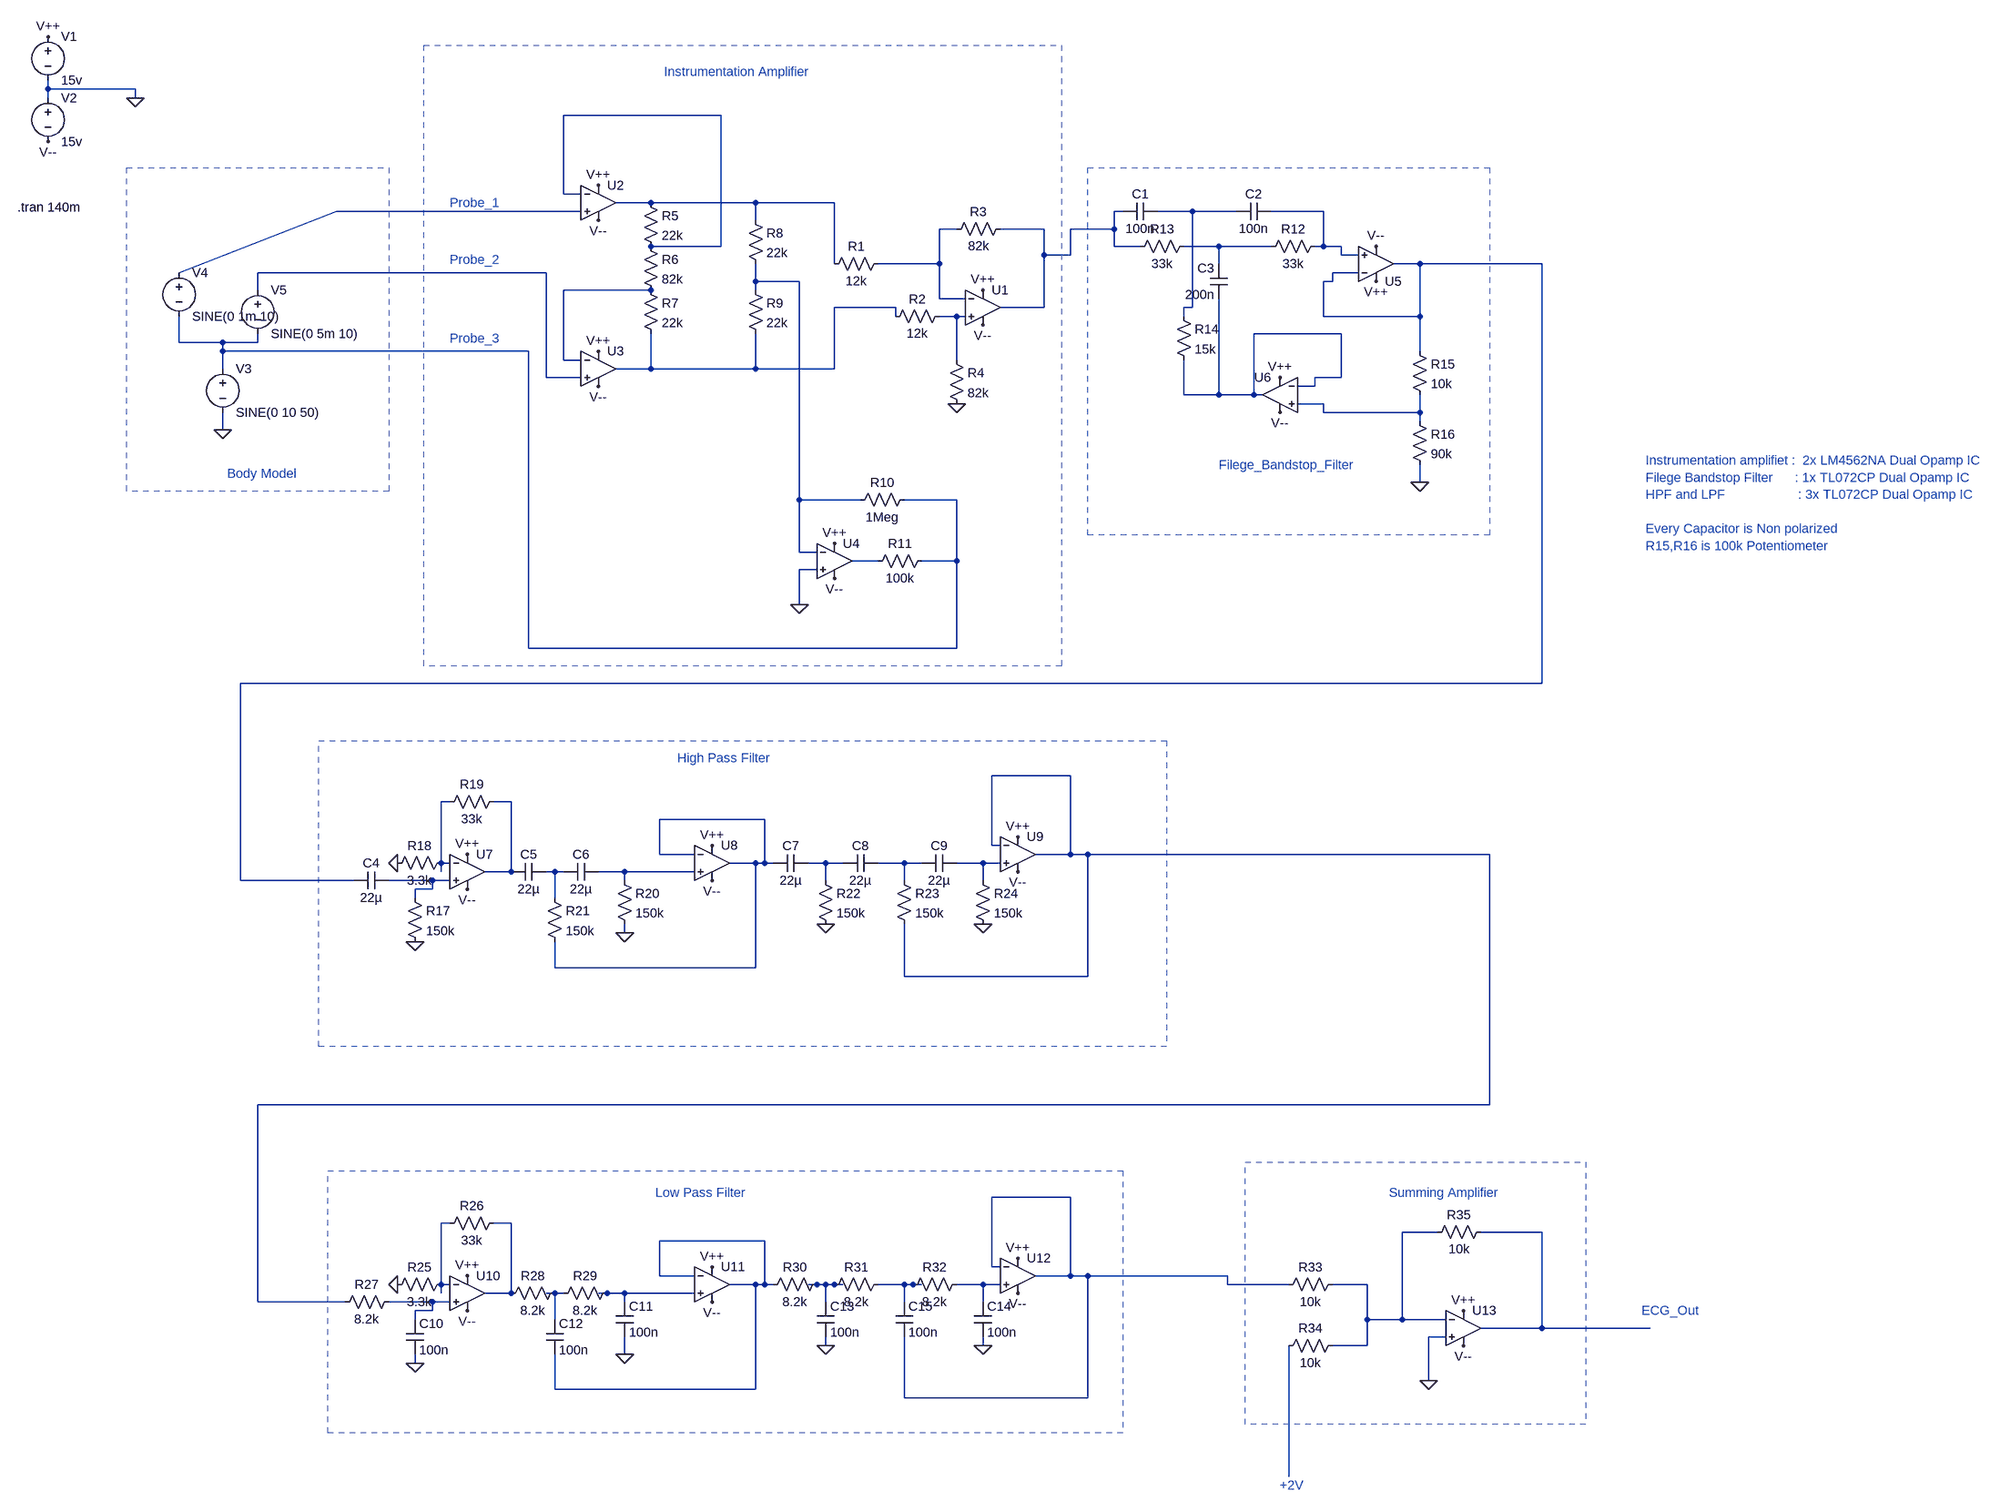
[diagram p0: schematic Full_Simulation.asc]
Full_Simulation.asc, the LTspice schematic file:
Version 4
SHEET 1 1884 2784
WIRE -1728 -80 -1728 -96
WIRE -1568 -80 -1728 -80
WIRE -1728 -64 -1728 -80
WIRE -1568 -64 -1568 -80
WIRE -496 -32 -784 -32
WIRE -784 112 -784 -32
WIRE -752 112 -784 112
WIRE -624 128 -688 128
WIRE -432 128 -624 128
WIRE -288 128 -432 128
WIRE -752 144 -1200 144
WIRE 240 144 224 144
WIRE 368 144 304 144
WIRE 448 144 368 144
WIRE 608 144 512 144
WIRE -432 160 -432 128
WIRE -64 176 -96 176
WIRE 96 176 16 176
WIRE 224 176 224 144
WIRE 224 176 144 176
WIRE -496 208 -496 -32
WIRE -496 208 -624 208
WIRE 224 208 224 176
WIRE 272 208 224 208
WIRE 416 208 352 208
WIRE 512 208 416 208
WIRE 608 208 608 144
WIRE 608 208 592 208
WIRE 640 208 608 208
WIRE 96 224 96 176
WIRE 144 224 144 176
WIRE 144 224 96 224
WIRE 640 224 640 208
WIRE 672 224 640 224
WIRE -288 240 -288 128
WIRE -96 240 -96 176
WIRE -96 240 -208 240
WIRE 416 240 416 208
WIRE 784 240 736 240
WIRE 1008 240 784 240
WIRE -1488 256 -1200 144
WIRE -816 256 -1344 256
WIRE 672 256 624 256
WIRE -432 272 -432 240
WIRE -352 272 -432 272
WIRE 624 272 624 256
WIRE 624 272 608 272
WIRE -1344 288 -1344 256
WIRE -624 288 -784 288
WIRE -432 288 -432 272
WIRE -96 304 -96 240
WIRE -48 304 -96 304
WIRE -176 320 -288 320
WIRE 96 320 96 224
WIRE 96 320 16 320
WIRE 368 320 368 144
WIRE 368 320 352 320
WIRE -176 336 -176 320
WIRE -64 336 -96 336
WIRE -48 336 -64 336
WIRE 352 336 352 320
WIRE 608 336 608 272
WIRE 784 336 784 240
WIRE 784 336 608 336
WIRE 640 368 480 368
WIRE -1488 384 -1488 336
WIRE -1408 384 -1488 384
WIRE -1344 384 -1344 368
WIRE -1344 384 -1408 384
WIRE -1408 400 -1408 384
WIRE -848 400 -1408 400
WIRE 784 400 784 336
WIRE -784 416 -784 288
WIRE -752 416 -784 416
WIRE -64 416 -64 336
WIRE -1408 432 -1408 400
WIRE -624 432 -624 368
WIRE -624 432 -688 432
WIRE -432 432 -432 368
WIRE -432 432 -624 432
WIRE -288 432 -288 320
WIRE -288 432 -432 432
WIRE -816 448 -816 256
WIRE -752 448 -816 448
WIRE 640 448 640 368
WIRE 640 448 592 448
WIRE 592 464 592 448
WIRE 592 464 560 464
WIRE 352 480 352 416
WIRE 416 480 416 304
WIRE 416 480 352 480
WIRE 480 480 480 368
WIRE 480 480 416 480
WIRE 496 480 480 480
WIRE 608 496 560 496
WIRE 608 512 608 496
WIRE 784 512 784 480
WIRE 784 512 608 512
WIRE 784 528 784 512
WIRE -1408 544 -1408 512
WIRE 784 640 784 608
WIRE -352 672 -352 272
WIRE -240 672 -352 672
WIRE -64 672 -160 672
WIRE -352 768 -352 672
WIRE -320 768 -352 768
WIRE -208 784 -256 784
WIRE -64 784 -64 672
WIRE -64 784 -128 784
WIRE -320 800 -352 800
WIRE -352 864 -352 800
WIRE -848 944 -848 400
WIRE -64 944 -64 784
WIRE -64 944 -848 944
WIRE 1008 1008 1008 240
WIRE 1008 1008 -1376 1008
WIRE 144 1232 0 1232
WIRE -992 1280 -1008 1280
WIRE -880 1280 -912 1280
WIRE -416 1312 -608 1312
WIRE 0 1360 0 1232
WIRE 16 1360 0 1360
WIRE -608 1376 -608 1312
WIRE -544 1376 -608 1376
WIRE 144 1376 144 1232
WIRE 144 1376 80 1376
WIRE 176 1376 144 1376
WIRE 912 1376 176 1376
WIRE -1008 1392 -1008 1280
WIRE -992 1392 -1008 1392
WIRE -432 1392 -480 1392
WIRE -416 1392 -416 1312
WIRE -416 1392 -432 1392
WIRE -400 1392 -416 1392
WIRE -304 1392 -336 1392
WIRE -272 1392 -304 1392
WIRE -160 1392 -208 1392
WIRE -128 1392 -160 1392
WIRE -16 1392 -64 1392
WIRE 16 1392 -16 1392
WIRE -1008 1408 -1008 1392
WIRE -880 1408 -880 1280
WIRE -880 1408 -928 1408
WIRE -800 1408 -816 1408
WIRE -784 1408 -800 1408
WIRE -672 1408 -720 1408
WIRE -544 1408 -672 1408
WIRE -1376 1424 -1376 1008
WIRE -1168 1424 -1376 1424
WIRE -1024 1424 -1104 1424
WIRE -992 1424 -1024 1424
WIRE -672 1424 -672 1408
WIRE -304 1424 -304 1392
WIRE -160 1424 -160 1392
WIRE -16 1424 -16 1392
WIRE -1024 1440 -1024 1424
WIRE -1024 1440 -1056 1440
WIRE -1056 1456 -1056 1440
WIRE -800 1456 -800 1408
WIRE -672 1520 -672 1504
WIRE -800 1584 -800 1536
WIRE -432 1584 -432 1392
WIRE -432 1584 -800 1584
WIRE -160 1600 -160 1504
WIRE 176 1600 176 1376
WIRE 176 1600 -160 1600
WIRE 912 1920 912 1376
WIRE 912 1920 -1344 1920
WIRE 144 2192 0 2192
WIRE -992 2240 -1008 2240
WIRE -880 2240 -912 2240
WIRE 816 2256 752 2256
WIRE 1008 2256 896 2256
WIRE -416 2272 -608 2272
WIRE 0 2320 0 2192
WIRE 16 2320 0 2320
WIRE -608 2336 -608 2272
WIRE -544 2336 -608 2336
WIRE 144 2336 144 2192
WIRE 144 2336 80 2336
WIRE 176 2336 144 2336
WIRE 432 2336 176 2336
WIRE -1008 2352 -1008 2240
WIRE -992 2352 -1008 2352
WIRE -432 2352 -480 2352
WIRE -416 2352 -416 2272
WIRE -416 2352 -432 2352
WIRE -400 2352 -416 2352
WIRE -320 2352 -336 2352
WIRE -304 2352 -320 2352
WIRE -288 2352 -304 2352
WIRE -272 2352 -288 2352
WIRE -160 2352 -208 2352
WIRE -144 2352 -160 2352
WIRE -128 2352 -144 2352
WIRE -16 2352 -64 2352
WIRE 16 2352 -16 2352
WIRE 432 2352 432 2336
WIRE 544 2352 432 2352
WIRE 688 2352 624 2352
WIRE -1008 2368 -1008 2352
WIRE -880 2368 -880 2240
WIRE -880 2368 -928 2368
WIRE -800 2368 -816 2368
WIRE -784 2368 -800 2368
WIRE -704 2368 -720 2368
WIRE -672 2368 -704 2368
WIRE -544 2368 -672 2368
WIRE -1344 2384 -1344 1920
WIRE -1184 2384 -1344 2384
WIRE -1024 2384 -1104 2384
WIRE -992 2384 -1024 2384
WIRE -672 2384 -672 2368
WIRE -304 2384 -304 2352
WIRE -160 2384 -160 2352
WIRE -16 2384 -16 2352
WIRE -1024 2400 -1024 2384
WIRE -1024 2400 -1056 2400
WIRE -1056 2416 -1056 2400
WIRE -800 2416 -800 2368
WIRE 688 2416 688 2352
WIRE 752 2416 752 2256
WIRE 752 2416 688 2416
WIRE 832 2416 752 2416
WIRE 1008 2432 1008 2256
WIRE 1008 2432 896 2432
WIRE 1216 2432 1008 2432
WIRE 832 2448 800 2448
WIRE -304 2464 -304 2448
WIRE -16 2464 -16 2448
WIRE 688 2464 688 2416
WIRE 688 2464 624 2464
WIRE -672 2480 -672 2448
WIRE -1056 2496 -1056 2480
WIRE 800 2528 800 2448
WIRE -800 2544 -800 2480
WIRE -432 2544 -432 2352
WIRE -432 2544 -800 2544
WIRE -160 2560 -160 2448
WIRE 176 2560 176 2336
WIRE 176 2560 -160 2560
WIRE 544 2704 544 2464
FLAG -1568 -64 0
FLAG -1728 -176 V++
FLAG -1728 16 V--
FLAG -16 288 V++
FLAG -16 352 V--
FLAG -64 496 0
FLAG -1408 544 0
FLAG -720 96 V++
FLAG -720 400 V++
FLAG -720 464 V--
FLAG -720 160 V--
FLAG -288 752 V++
FLAG -288 816 V--
FLAG -352 864 0
FLAG 784 640 0
FLAG 528 448 V++
FLAG 528 512 V--
FLAG 704 272 V++
FLAG 704 208 V--
FLAG -1088 1392 0
FLAG -672 1520 0
FLAG -16 1504 0
FLAG -304 1504 0
FLAG -1056 1536 0
FLAG -960 1376 V++
FLAG -512 1360 V++
FLAG 48 1344 V++
FLAG 48 1408 V--
FLAG -512 1424 V--
FLAG -960 1440 V--
FLAG -1088 2352 0
FLAG -672 2480 0
FLAG -16 2464 0
FLAG -304 2464 0
FLAG -1056 2496 0
FLAG -960 2336 V++
FLAG -512 2320 V++
FLAG 48 2304 V++
FLAG 48 2368 V--
FLAG -512 2384 V--
FLAG -960 2400 V--
FLAG 864 2400 V++
FLAG 864 2464 V--
FLAG 800 2528 0
SYMBOL voltage -1728 -192 R0
WINDOW 123 0 0 Left 0
WINDOW 39 0 0 Left 0
SYMATTR InstName V1
SYMATTR Value 15v
SYMBOL voltage -1728 -80 R0
WINDOW 123 0 0 Left 0
WINDOW 39 0 0 Left 0
SYMATTR InstName V2
SYMATTR Value 15v
SYMBOL OpAmps\\UniversalOpAmp2 -16 320 R0
SYMATTR InstName U1
SYMBOL res -192 224 R90
WINDOW 0 0 56 VBottom 2
WINDOW 3 32 56 VTop 2
SYMATTR InstName R1
SYMATTR Value 12k
SYMBOL res -80 320 R90
WINDOW 0 0 56 VBottom 2
WINDOW 3 32 56 VTop 2
SYMATTR InstName R2
SYMATTR Value 12k
SYMBOL res 32 160 R90
WINDOW 0 0 56 VBottom 2
WINDOW 3 32 56 VTop 2
SYMATTR InstName R3
SYMATTR Value 82k
SYMBOL res -80 400 R0
SYMATTR InstName R4
SYMATTR Value 82k
SYMBOL voltage -1408 416 R0
WINDOW 123 0 0 Left 0
WINDOW 39 0 0 Left 0
SYMATTR InstName V3
SYMATTR Value SINE(0 10 50)
SYMBOL voltage -1488 240 R0
WINDOW 123 0 0 Left 0
WINDOW 39 0 0 Left 0
SYMATTR InstName V4
SYMATTR Value SINE(0 1m 10)
SYMBOL voltage -1344 272 R0
WINDOW 123 0 0 Left 0
WINDOW 39 0 0 Left 0
SYMATTR InstName V5
SYMATTR Value SINE(0 5m 10)
SYMBOL OpAmps\\UniversalOpAmp2 -720 128 R0
SYMATTR InstName U2
SYMBOL OpAmps\\UniversalOpAmp2 -720 432 R0
SYMATTR InstName U3
SYMBOL res -640 112 R0
SYMATTR InstName R5
SYMATTR Value 22k
SYMBOL res -640 192 R0
SYMATTR InstName R6
SYMATTR Value 82k
SYMBOL res -640 272 R0
SYMATTR InstName R7
SYMATTR Value 22k
SYMBOL OpAmps\\UniversalOpAmp2 -288 784 R0
SYMATTR InstName U4
SYMBOL res -448 144 R0
SYMATTR InstName R8
SYMATTR Value 22k
SYMBOL res -448 272 R0
SYMATTR InstName R9
SYMATTR Value 22k
SYMBOL res -144 656 R90
WINDOW 0 0 56 VBottom 2
WINDOW 3 32 56 VTop 2
SYMATTR InstName R10
SYMATTR Value 1Meg
SYMBOL res -112 768 R90
WINDOW 0 0 56 VBottom 2
WINDOW 3 32 56 VTop 2
SYMATTR InstName R11
SYMATTR Value 100k
SYMBOL cap 304 128 R90
WINDOW 0 0 32 VBottom 2
WINDOW 3 32 32 VTop 2
SYMATTR InstName C1
SYMATTR Value 100n
SYMBOL cap 512 128 R90
WINDOW 0 0 32 VBottom 2
WINDOW 3 32 32 VTop 2
SYMATTR InstName C2
SYMATTR Value 100n
SYMBOL cap 432 304 R180
WINDOW 0 24 56 Left 2
WINDOW 3 24 8 Left 2
SYMATTR InstName C3
SYMATTR Value 200n
SYMBOL res 608 192 R90
WINDOW 0 0 56 VBottom 2
WINDOW 3 32 56 VTop 2
SYMATTR InstName R12
SYMATTR Value 33k
SYMBOL res 368 192 R90
WINDOW 0 0 56 VBottom 2
WINDOW 3 32 56 VTop 2
SYMATTR InstName R13
SYMATTR Value 33k
SYMBOL res 336 320 R0
SYMATTR InstName R14
SYMATTR Value 15k
SYMBOL res 768 384 R0
SYMATTR InstName R15
SYMATTR Value 10k
SYMBOL res 768 512 R0
SYMATTR InstName R16
SYMATTR Value 90k
SYMBOL OpAmps\\UniversalOpAmp2 704 240 M180
SYMATTR InstName U5
SYMBOL OpAmps\\UniversalOpAmp2 528 480 M0
SYMATTR InstName U6
SYMBOL OpAmps\\UniversalOpAmp2 -960 1408 R0
SYMATTR InstName U7
SYMBOL cap -1104 1408 R90
WINDOW 0 0 32 VBottom 2
WINDOW 3 32 32 VTop 2
SYMATTR InstName C4
SYMATTR Value 22µ
SYMBOL res -1072 1440 R0
SYMATTR InstName R17
SYMATTR Value 150k
SYMBOL res -992 1376 R90
WINDOW 0 0 56 VBottom 2
WINDOW 3 32 56 VTop 2
SYMATTR InstName R18
SYMATTR Value 3.3k
SYMBOL res -1008 1296 R270
WINDOW 0 32 56 VTop 2
WINDOW 3 0 56 VBottom 2
SYMATTR InstName R19
SYMATTR Value 33k
SYMBOL cap -816 1392 R90
WINDOW 0 0 32 VBottom 2
WINDOW 3 32 32 VTop 2
SYMATTR InstName C5
SYMATTR Value 22µ
SYMBOL cap -720 1392 R90
WINDOW 0 0 32 VBottom 2
WINDOW 3 32 32 VTop 2
SYMATTR InstName C6
SYMATTR Value 22µ
SYMBOL res -688 1408 R0
SYMATTR InstName R20
SYMATTR Value 150k
SYMBOL OpAmps\\UniversalOpAmp2 -512 1392 R0
SYMATTR InstName U8
SYMBOL res -816 1440 R0
SYMATTR InstName R21
SYMATTR Value 150k
SYMBOL cap -336 1376 R90
WINDOW 0 0 32 VBottom 2
WINDOW 3 32 32 VTop 2
SYMATTR InstName C7
SYMATTR Value 22µ
SYMBOL cap -208 1376 R90
WINDOW 0 0 32 VBottom 2
WINDOW 3 32 32 VTop 2
SYMATTR InstName C8
SYMATTR Value 22µ
SYMBOL cap -64 1376 R90
WINDOW 0 0 32 VBottom 2
WINDOW 3 32 32 VTop 2
SYMATTR InstName C9
SYMATTR Value 22µ
SYMBOL OpAmps\\UniversalOpAmp2 48 1376 R0
SYMATTR InstName U9
SYMBOL res -320 1408 R0
SYMATTR InstName R22
SYMATTR Value 150k
SYMBOL res -176 1408 R0
SYMATTR InstName R23
SYMATTR Value 150k
SYMBOL res -32 1408 R0
SYMATTR InstName R24
SYMATTR Value 150k
SYMBOL OpAmps\\UniversalOpAmp2 -960 2368 R0
SYMATTR InstName U10
SYMBOL res -992 2336 R90
WINDOW 0 0 56 VBottom 2
WINDOW 3 32 56 VTop 2
SYMATTR InstName R25
SYMATTR Value 3.3k
SYMBOL res -1008 2256 R270
WINDOW 0 32 56 VTop 2
WINDOW 3 0 56 VBottom 2
SYMATTR InstName R26
SYMATTR Value 33k
SYMBOL OpAmps\\UniversalOpAmp2 -512 2352 R0
SYMATTR InstName U11
SYMBOL OpAmps\\UniversalOpAmp2 48 2336 R0
SYMATTR InstName U12
SYMBOL res -1088 2368 R90
WINDOW 0 0 56 VBottom 2
WINDOW 3 32 56 VTop 2
SYMATTR InstName R27
SYMATTR Value 8.2k
SYMBOL res -784 2352 R90
WINDOW 0 0 56 VBottom 2
WINDOW 3 32 56 VTop 2
SYMATTR InstName R28
SYMATTR Value 8.2k
SYMBOL res -688 2352 R90
WINDOW 0 0 56 VBottom 2
WINDOW 3 32 56 VTop 2
SYMATTR InstName R29
SYMATTR Value 8.2k
SYMBOL res -304 2336 R90
WINDOW 0 0 56 VBottom 2
WINDOW 3 32 56 VTop 2
SYMATTR InstName R30
SYMATTR Value 8.2k
SYMBOL res -192 2336 R90
WINDOW 0 0 56 VBottom 2
WINDOW 3 32 56 VTop 2
SYMATTR InstName R31
SYMATTR Value 8.2k
SYMBOL res -48 2336 R90
WINDOW 0 0 56 VBottom 2
WINDOW 3 32 56 VTop 2
SYMATTR InstName R32
SYMATTR Value 8.2k
SYMBOL cap -1072 2416 R0
SYMATTR InstName C10
SYMATTR Value 100n
SYMBOL cap -688 2384 R0
SYMATTR InstName C11
SYMATTR Value 100n
SYMBOL cap -816 2416 R0
SYMATTR InstName C12
SYMATTR Value 100n
SYMBOL cap -320 2384 R0
SYMATTR InstName C13
SYMATTR Value 100n
SYMBOL cap -32 2384 R0
SYMATTR InstName C14
SYMATTR Value 100n
SYMBOL cap -176 2384 R0
SYMATTR InstName C15
SYMATTR Value 100n
SYMBOL OpAmps\\UniversalOpAmp2 864 2432 R0
SYMATTR InstName U13
SYMBOL res 640 2336 R90
WINDOW 0 0 56 VBottom 2
WINDOW 3 32 56 VTop 2
SYMATTR InstName R33
SYMATTR Value 10k
SYMBOL res 640 2448 R90
WINDOW 0 0 56 VBottom 2
WINDOW 3 32 56 VTop 2
SYMATTR InstName R34
SYMATTR Value 10k
SYMBOL res 912 2240 R90
WINDOW 0 0 56 VBottom 2
WINDOW 3 32 56 VTop 2
SYMATTR InstName R35
SYMATTR Value 10k
TEXT -1784 136 Left 2 !.tran 140m
TEXT 416 608 Left 2 ;Filege_Bandstop_Filter
TEXT -616 2184 Left 2 ;Low Pass Filter
TEXT -576 1200 Left 2 ;High Pass Filter
TEXT -1400 624 Left 2 ;Body Model
TEXT -600 -112 Left 2 ;Instrumentation Amplifier
TEXT 1208 600 Left 2 ;Instrumentation amplifiet :  2x LM4562NA Dual Opamp IC\nFilege Bandstop Filter      : 1x TL072CP Dual Opamp IC\nHPF and LPF                    : 3x TL072CP Dual Opamp IC\n \nEvery Capacitor is Non polarized\nR15,R16 is 100k Potentiometer
TEXT -992 128 Left 2 ;Probe_1
TEXT -992 232 Left 2 ;Probe_2
TEXT -992 376 Left 2 ;Probe_3
TEXT 728 2184 Left 2 ;Summing Amplifier
TEXT 528 2720 Left 2 ;+2V
TEXT 1200 2400 Left 2 ;ECG_Out
RECTANGLE Normal 912 736 176 64 2
RECTANGLE Normal 128 976 -1040 -160 2
RECTANGLE Normal -1104 656 -1584 64 2
RECTANGLE Normal 320 1728 -1232 1168 2
RECTANGLE Normal 240 2624 -1216 2144 2
RECTANGLE Normal 1088 2608 464 2128 2

The netlist it stands for:
* Full_Simulation.asc
V1 V++ 0 15v
V2 0 V-- 15v
XU1 N014 N007 V++ V-- N004 level2 Avol=1Meg GBW=10Meg Slew=10Meg Ilimit=25m Rail=0 Vos=0 En=0 Enk=0 In=0 Ink=0 Rin=500Meg  ; pins In+ In- V+ V- OUT
R1 N007 N002 12k
R2 N014 N013 12k
R3 N004 N007 82k
R4 N014 0 82k
V3 N016 0 SINE(0 10 50)
V4 N003 N016 SINE(0 1m 10)
V5 N010 N016 SINE(0 5m 10)
XU2 N003 N001 V++ V-- N002 level2 Avol=1Meg GBW=10Meg Slew=10Meg Ilimit=25m Rail=0 Vos=0 En=0 Enk=0 In=0 Ink=0 Rin=500Meg  ; pins In+ In- V+ V- OUT
XU3 N010 N012 V++ V-- N013 level2 Avol=1Meg GBW=10Meg Slew=10Meg Ilimit=25m Rail=0 Vos=0 En=0 Enk=0 In=0 Ink=0 Rin=500Meg  ; pins In+ In- V+ V- OUT
R5 N002 N001 22k
R6 N001 N012 82k
R7 N012 N013 22k
XU4 0 N011 V++ V-- N018 level2 Avol=1Meg GBW=10Meg Slew=10Meg Ilimit=25m Rail=0 Vos=0 En=0 Enk=0 In=0 Ink=0 Rin=500Meg  ; pins In+ In- V+ V- OUT
R8 N002 N011 22k
R9 N011 N013 22k
R10 N016 N011 1Meg
R11 N016 N018 100k
C1 N005 N004 100n
C2 N006 N005 100n
C3 N015 N008 200n
R12 N006 N008 33k
R13 N008 N004 33k
R14 N005 N015 15k
R15 N009 N017 10k
R16 N017 0 90k
XU5 N006 N009 V++ V-- N009 level2 Avol=1Meg GBW=10Meg Slew=10Meg Ilimit=25m Rail=0 Vos=0 En=0 Enk=0 In=0 Ink=0 Rin=500Meg  ; pins In+ In- V+ V- OUT
XU6 N017 N015 V++ V-- N015 level2 Avol=1Meg GBW=10Meg Slew=10Meg Ilimit=25m Rail=0 Vos=0 En=0 Enk=0 In=0 Ink=0 Rin=500Meg  ; pins In+ In- V+ V- OUT
XU7 N028 N020 V++ V-- N021 level2 Avol=1Meg GBW=10Meg Slew=10Meg Ilimit=25m Rail=0 Vos=0 En=0 Enk=0 In=0 Ink=0 Rin=500Meg  ; pins In+ In- V+ V- OUT
C4 N028 N009 22µ
R17 N028 0 150k
R18 N020 0 3.3k
R19 N020 N021 33k
C5 N026 N021 22µ
C6 N027 N026 22µ
R20 N027 0 150k
XU8 N027 N022 V++ V-- N022 level2 Avol=1Meg GBW=10Meg Slew=10Meg Ilimit=25m Rail=0 Vos=0 En=0 Enk=0 In=0 Ink=0 Rin=500Meg  ; pins In+ In- V+ V- OUT
R21 N026 N022 150k
C7 N023 N022 22µ
C8 N024 N023 22µ
C9 N025 N024 22µ
XU9 N025 N019 V++ V-- N019 level2 Avol=1Meg GBW=10Meg Slew=10Meg Ilimit=25m Rail=0 Vos=0 En=0 Enk=0 In=0 Ink=0 Rin=500Meg  ; pins In+ In- V+ V- OUT
R22 N023 0 150k
R23 N024 N019 150k
R24 N025 0 150k
XU10 N040 N030 V++ V-- N031 level2 Avol=1Meg GBW=10Meg Slew=10Meg Ilimit=25m Rail=0 Vos=0 En=0 Enk=0 In=0 Ink=0 Rin=500Meg  ; pins In+ In- V+ V- OUT
R25 N030 0 3.3k
R26 N030 N031 33k
XU11 N039 N034 V++ V-- N034 level2 Avol=1Meg GBW=10Meg Slew=10Meg Ilimit=25m Rail=0 Vos=0 En=0 Enk=0 In=0 Ink=0 Rin=500Meg  ; pins In+ In- V+ V- OUT
XU12 N037 N029 V++ V-- N029 level2 Avol=1Meg GBW=10Meg Slew=10Meg Ilimit=25m Rail=0 Vos=0 En=0 Enk=0 In=0 Ink=0 Rin=500Meg  ; pins In+ In- V+ V- OUT
R27 N040 N019 8.2k
R28 N038 N031 8.2k
R29 N039 N038 8.2k
R30 N035 N034 8.2k
R31 N036 N035 8.2k
R32 N037 N036 8.2k
C10 N040 0 100n
C11 N039 0 100n
C12 N038 N034 100n
C13 N035 0 100n
C14 N037 0 100n
C15 N036 N029 100n
XU13 0 N032 V++ V-- N033 level2 Avol=1Meg GBW=10Meg Slew=10Meg Ilimit=25m Rail=0 Vos=0 En=0 Enk=0 In=0 Ink=0 Rin=500Meg  ; pins In+ In- V+ V- OUT
R33 N032 N029 10k
R34 N032 N041 10k
R35 N033 N032 10k
.tran 140m
* Filege_Bandstop_Filter
* Low Pass Filter
* High Pass Filter
* Body Model
* Instrumentation Amplifier
* Instrumentation amplifiet :  2x LM4562NA Dual Opamp IC
* Filege Bandstop Filter      : 1x TL072CP Dual Opamp IC
* HPF and LPF                    : 3x TL072CP Dual Opamp IC
* Every Capacitor is Non polarized
* R15,R16 is 100k Potentiometer
* Probe_1
* Probe_2
* Probe_3
* Summing Amplifier
* +2V
* ECG_Out
.lib UniversalOpAmp2.lib
.backanno
.end